# Altium project ACTUATOR.PrjPcb
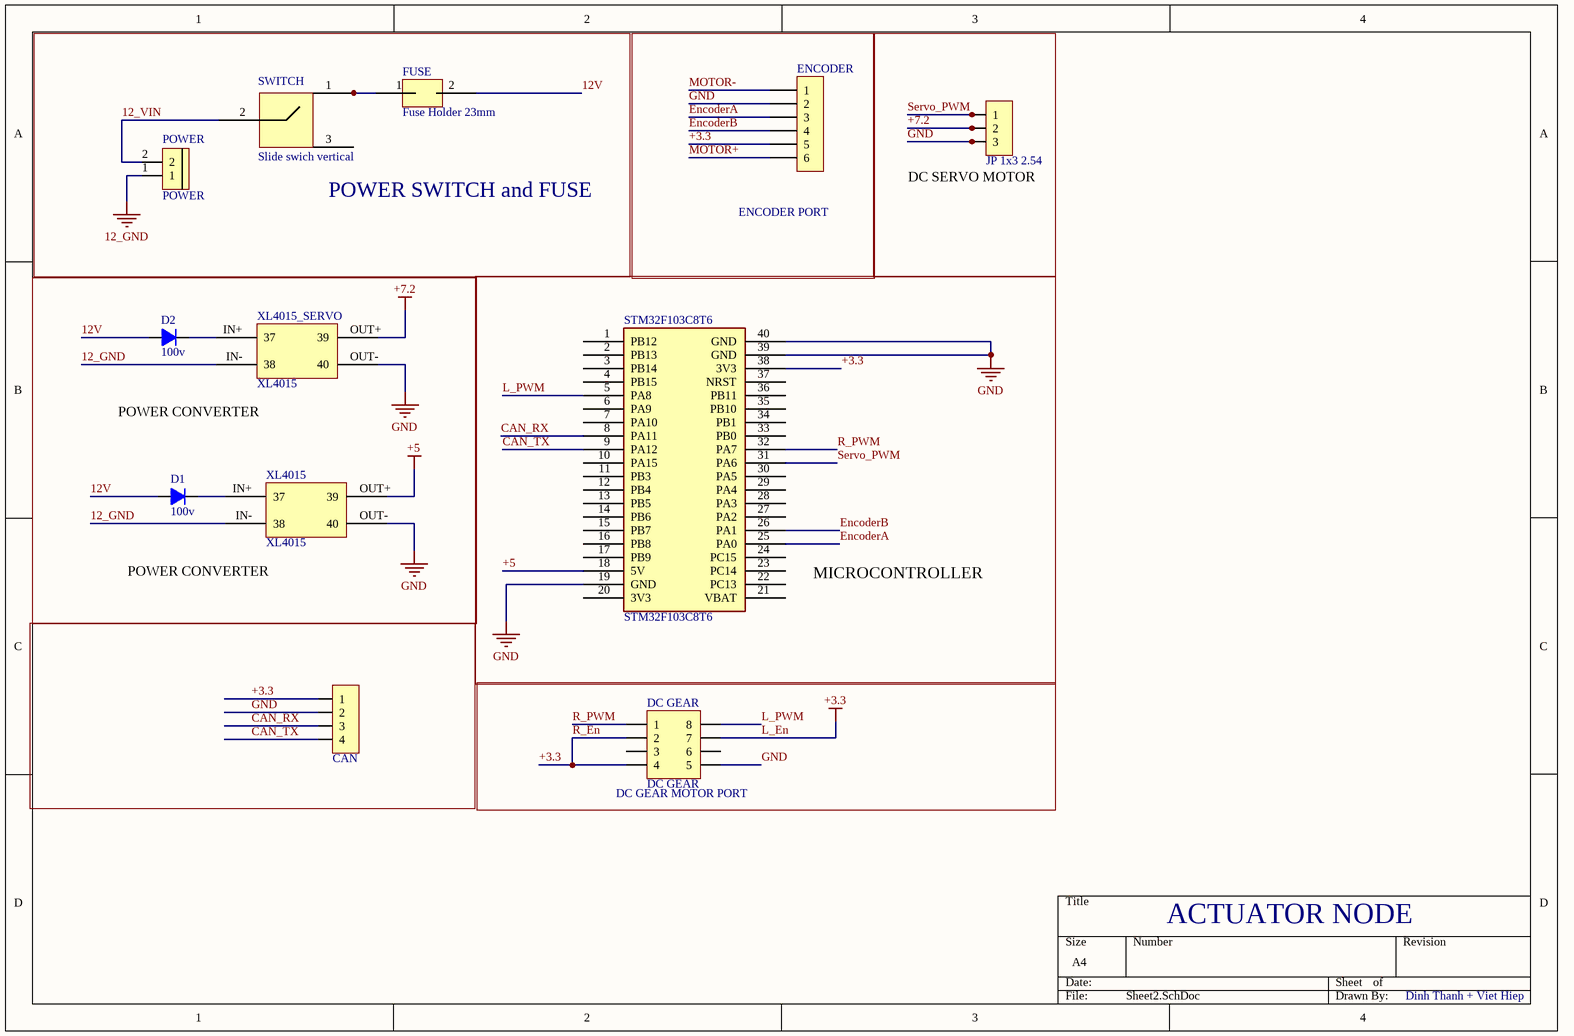
[diagram p0: Sheet2.SchDoc]
1 sheet, 12 parts. Net scope: global (net labels, ports and power ports of the same name join across sheets).
Board file: PCB3.PcbDoc

## Sheet Sheet2.SchDoc
size A4; SheetNumber: 1; SheetTotal: 1

### Parts
CAN  CAN  [JP 1x4 CC]
D1  100v  [DIODE 1A]
D2  100v  [DIODE 1A]
DC_GEAR  DC GEAR  [JP4-C2T]
ENCODER  Header 6P 2.54 Duc Thang  [XH2.54M-6]  (value not drawn)
FUSE  Fuse Holder 23mm  [Fuse3]
JP?  JP 1x3 2.54  [JP 1x3 DT]
POWER  POWER  [Con 2 KF301 5.08]
STM32F103C8T6  STM32F103C8T6  [Stm32 BluePill]
SWITCH  Slide swich vertical  [SW102T]
XL4015  XL4015  [XL4015]
XL4015_SERVO  XL4015  [XL4015]

### Blocks framed on the sheet
POWER SWITCH and FUSE: FUSE POWER SWITCH
ENCODER PORT: ENCODER
DC GEAR MOTOR PORT: DC_GEAR

### Nets
12_GND: POWER.1 XL4015.IN-(38) XL4015_SERVO.IN-(38)
+3.3: CAN.1 DC_GEAR.2 DC_GEAR.4 DC_GEAR.7 ENCODER.5 STM32F103C8T6.38(3V3)  [also labelled L_En, R_En]
+5: STM32F103C8T6.18(5V) XL4015.OUT+(39)
+7.2: JP?.2 XL4015_SERVO.OUT+(39)
GND: CAN.2 DC_GEAR.5 ENCODER.2 JP?.3 STM32F103C8T6.19(GND) STM32F103C8T6.39(GND) STM32F103C8T6.40(GND) XL4015.OUT-(40) XL4015_SERVO.OUT-(40)
12_VIN: POWER.2 SWITCH.2
12V: D1.1(A) D2.1(A) FUSE.2
CAN_RX: CAN.3 STM32F103C8T6.8(PA11)
CAN_TX: CAN.4 STM32F103C8T6.9(PA12)
EncoderA: ENCODER.3 STM32F103C8T6.25(PA0)
EncoderB: ENCODER.4 STM32F103C8T6.26(PA1)
L_PWM: DC_GEAR.8 STM32F103C8T6.5(PA8)
MOTOR+: ENCODER.6
MOTOR-: ENCODER.1
R_PWM: DC_GEAR.1 STM32F103C8T6.32(PA7)
Servo_PWM: JP?.1 STM32F103C8T6.31(PA6)
NetD1_2: D1.2(K) XL4015.IN+(37)
NetD2_2: D2.2(K) XL4015_SERVO.IN+(37)
NetFUSE_1: FUSE.1 SWITCH.1

Not connected (* = marked no-connect by the designer): DC_GEAR 3 6; STM32F103C8T6 1(PB12) 2(PB13) 3(PB14) 4(PB15) 6(PA9) 7(PA10) 10(PA15) 11(PB3) 12(PB4) 13(PB5) 14(PB6) 15(PB7) 16(PB8) 17(PB9) 20(3V3) 21(VBAT) 22(PC13) 23(PC14) 24(PC15) 27(PA2) 28(PA3) 29(PA4) 30(PA5) 33(PB0) 34(PB1) 35(PB10) 36(PB11) 37(NRST); SWITCH 3(43)

### Notes on the sheet
- (near JP?) DC SERVO MOTOR PORT
- (near XL4015_SERVO) POWER CONVERTER
- (near XL4015) POWER CONVERTER
- MICROCONTROLLER
- ACTUATOR NODE
- Dinh Thanh + Viet Hiep

### Library data of the parts
CAN = JP 1x4 2.54 Cai Cong: Cắm; Ten_Linh_Kien: Jump Đơn Cái 2.54MM 1x40P Cong; Don_Vi: Con; Ma_Hang: MH001265; Ghi_Chu: *; Kieu_Chan: *; Chung_Loai: Cắm
D1 D2 = Diode 1N4007: Cắm; Ten_Linh_Kien: Diode 1N4007 1A (DIP); Don_Vi: Con; Ma_Hang: MH001063; Ghi Chu: *; Kieu_Chan: *; Chung_Loai: Cắm
DC_GEAR = JP4x2: WR-PHD 2.54 mm Dual Socket Header; Manufacturer: W¨¹rth Elektronik eiSos GmbH; partNo: 61300821821; ComponentLink1 Description: Manufacturer; ComponentLink2 Description: Datasheet; NoPins: 08; Created Date: 29 March 2013; ComponentLink1URL: http://www.we-online.com; ComponentLink2URL: http://katalog.we-online.de/em/datasheet/6130xx21821.pdf; Created by: Karrer Zheng
ENCODER = Header 6P 2.54 Duc Thang: Cắm; Ten_Linh_Kien: Header 6P XH2.54-6P Đực Thẳng; Don_Vi: Con; Ma_Hang: MH001972; Chung_Loai: Cắm
JP? = JP 1x3 2.54 Duc Thang: Cắm; Ten_Linh_Kien: Jump Đơn Đực 2.54MM 1x40P Thẳng 11MM; Don_Vi: Con; Ma_Hang: MH000903; Ghi_Chu: *; Kieu_Chan: *; Chung_Loai: Cắm
POWER = CON 2 KF301: Cắm; Ma_Hang: MH000987; Ten_Linh_Kien: CON 2 KF301-2P 5.08MM Xanh Dương; Don_Vi: Con; Chung_Loai: Cắm; Ghi_Chu: *; Kieu_Chan: *
STM32F103C8T6 = BluePill: Designed By @Alixahedi